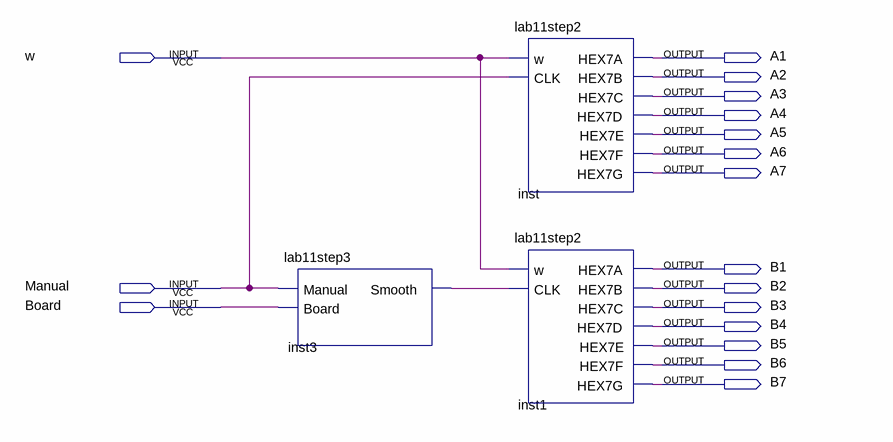
[diagram p0: schematic sheet]
// Quartus schematic lab11step4.bdf as structural Verilog: 3 symbols, 17 pins
module lab11step4 (
  input  w,
  input  Manual,
  input  Board,
  output A1,
  output A2,
  output A3,
  output A4,
  output A5,
  output A6,
  output A7,
  output B1,
  output B2,
  output B3,
  output B4,
  output B5,
  output B6,
  output B7
);

  wire inst3_smooth;

  lab11step3 inst3 (.Manual(Manual), .Board(Board), .Smooth(inst3_smooth));
  lab11step2 inst (
    .w(w), .CLK(Manual), .HEX7A(A1), .HEX7B(A2), .HEX7C(A3), .HEX7D(A4), .HEX7E(A5), .HEX7F(A6), .HEX7G(A7));
  lab11step2 inst1 (
    .w(w), .CLK(inst3_smooth), .HEX7A(B1), .HEX7B(B2), .HEX7C(B3), .HEX7D(B4), .HEX7E(B5), .HEX7F(B6),
    .HEX7G(B7));
endmodule
